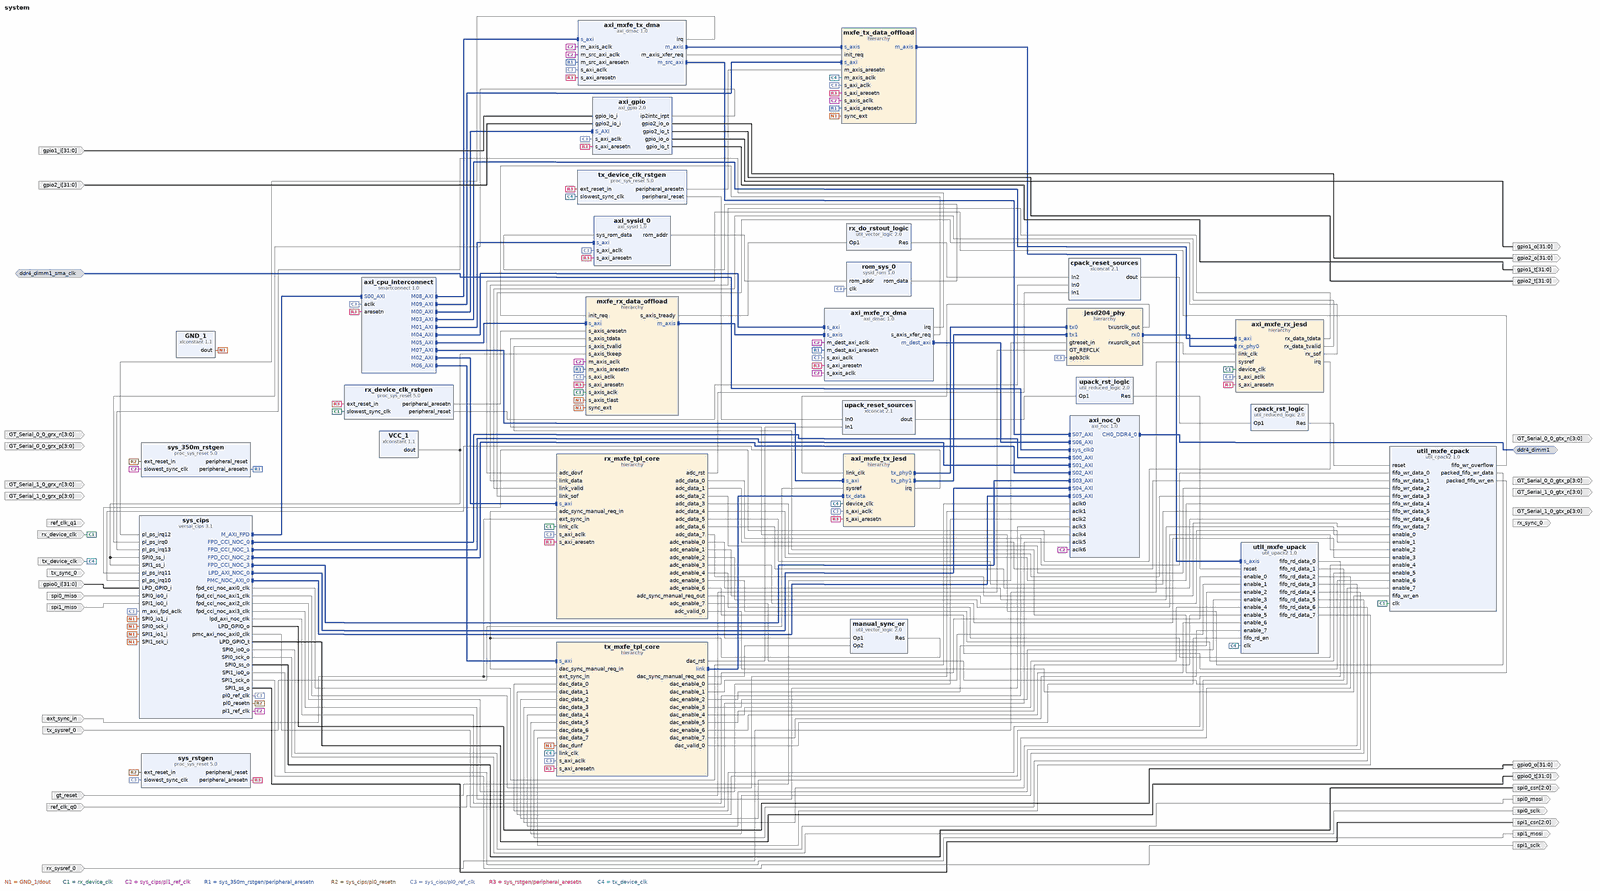
[diagram p0: block diagram of the top level, whole]
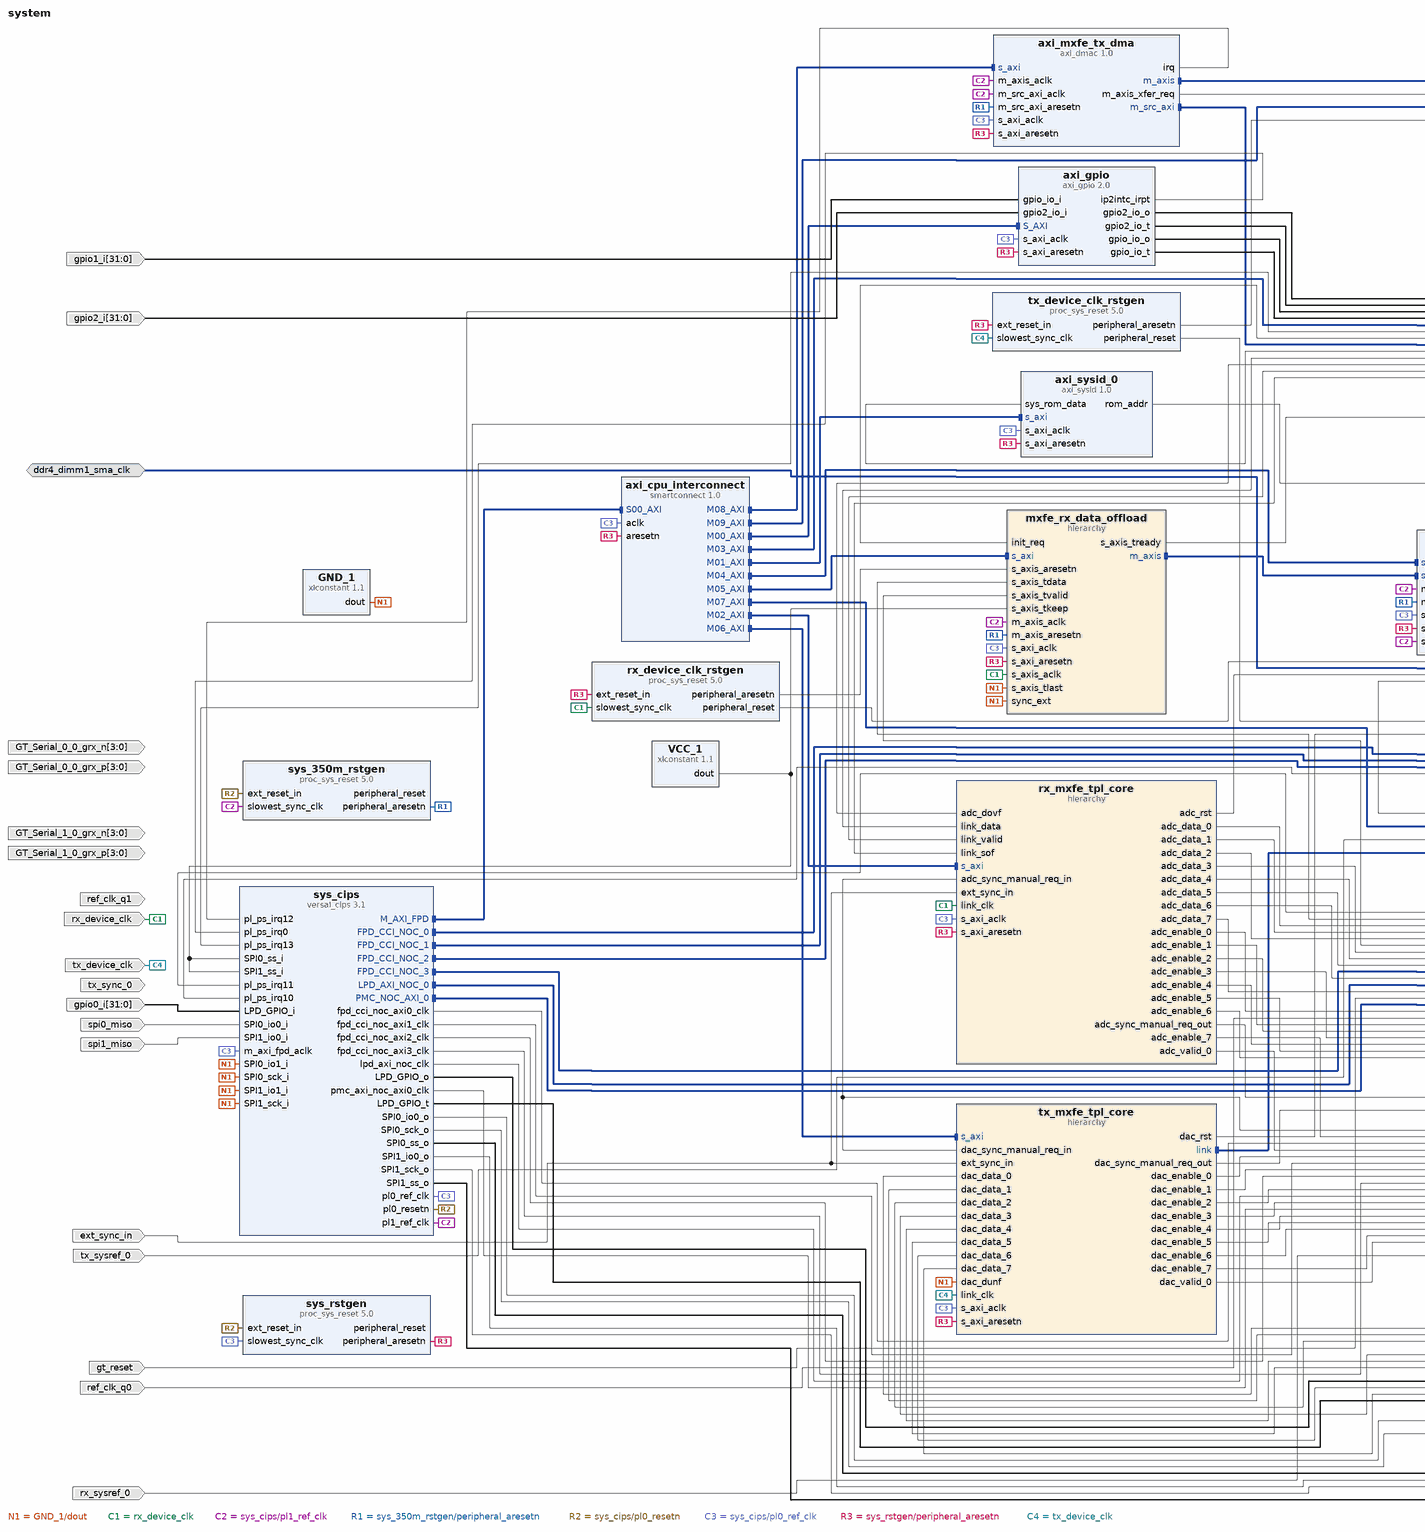
[diagram p1: block diagram of the top level, left part]
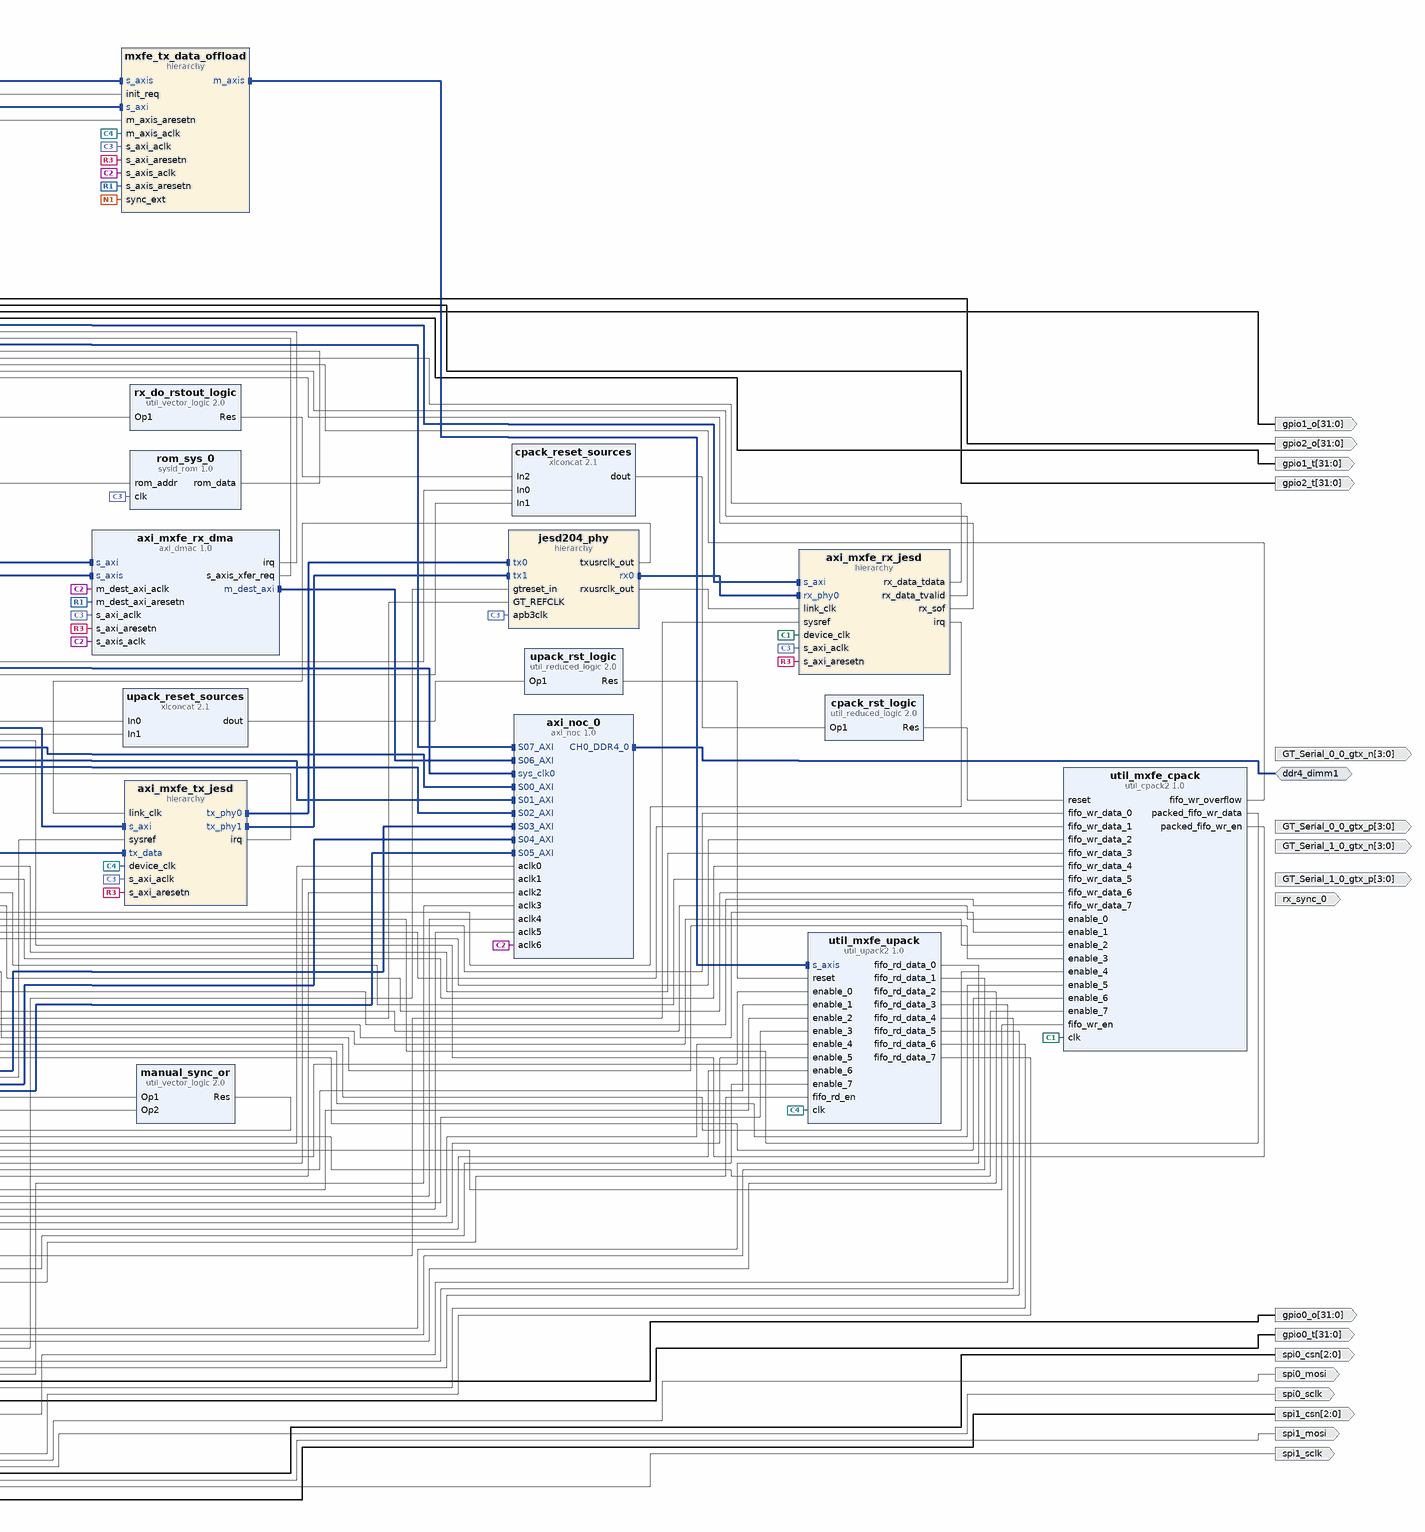
[diagram p2: block diagram of the top level, right part]
# Vivado block design system, xcvc1902-vsva2197-2MP-e-S, Vivado 2021.2
create_bd_design system

create_bd_intf_port -mode Master -vlnv xilinx.com:interface:ddr4_rtl:1.0 ddr4_dimm1
create_bd_intf_port -mode Slave -vlnv xilinx.com:interface:diff_clock_rtl:1.0 ddr4_dimm1_sma_clk
set_property -dict {CONFIG.FREQ_HZ 200000000} [get_bd_intf_ports ddr4_dimm1_sma_clk]
create_bd_port -dir O -from 2 -to 0 spi0_csn
create_bd_port -dir O spi0_sclk
create_bd_port -dir O spi0_mosi
create_bd_port -dir I spi0_miso
create_bd_port -dir O -from 2 -to 0 spi1_csn
create_bd_port -dir O spi1_sclk
create_bd_port -dir O spi1_mosi
create_bd_port -dir I spi1_miso
create_bd_port -dir I -from 31 -to 0 gpio0_i
create_bd_port -dir O -from 31 -to 0 gpio0_o
create_bd_port -dir O -from 31 -to 0 gpio0_t
create_bd_port -dir I -from 31 -to 0 gpio1_i
create_bd_port -dir O -from 31 -to 0 gpio1_o
create_bd_port -dir O -from 31 -to 0 gpio1_t
create_bd_port -dir I -from 31 -to 0 gpio2_i
create_bd_port -dir O -from 31 -to 0 gpio2_o
create_bd_port -dir O -from 31 -to 0 gpio2_t
create_bd_port -dir I gt_reset
create_bd_port -dir I rx_device_clk
create_bd_port -dir I tx_device_clk
create_bd_port -dir I ref_clk_q0
create_bd_port -dir I ref_clk_q1
create_bd_port -dir I rx_sysref_0
create_bd_port -dir O rx_sync_0
create_bd_port -dir I tx_sysref_0
create_bd_port -dir I tx_sync_0
create_bd_port -dir I -from 3 -to 0 GT_Serial_0_0_grx_p
create_bd_port -dir I -from 3 -to 0 GT_Serial_0_0_grx_n
create_bd_port -dir O -from 3 -to 0 GT_Serial_0_0_gtx_p
create_bd_port -dir O -from 3 -to 0 GT_Serial_0_0_gtx_n
create_bd_port -dir I -from 3 -to 0 GT_Serial_1_0_grx_p
create_bd_port -dir I -from 3 -to 0 GT_Serial_1_0_grx_n
create_bd_port -dir O -from 3 -to 0 GT_Serial_1_0_gtx_p
create_bd_port -dir O -from 3 -to 0 GT_Serial_1_0_gtx_n
create_bd_port -dir I ext_sync_in

create_bd_cell -type ip -vlnv xilinx.com:ip:versal_cips:3.1 sys_cips
set_property -dict [list \
  CONFIG.CLOCK_MODE Custom \
  CONFIG.DDR_MEMORY_MODE Custom \
  CONFIG.DEBUG_MODE JTAG \
  CONFIG.DESIGN_MODE 1 \
  CONFIG.IO_CONFIG_MODE Custom \
  CONFIG.PS_BOARD_INTERFACE ps_pmc_fixed_io \
  CONFIG.PS_PL_CONNECTIVITY_MODE Custom \
  CONFIG.PS_PMC_CONFIG {CLOCK_MODE Custom DDR_MEMORY_MODE {Connectivity to DDR via NOC} DEBUG_MODE JTAG DESIGN_MODE 1 IO_CONFIG_MODE Custom PCIE_APERTURES_DUAL_ENABLE 0 PCIE_APERTURES_SINGLE_ENABLE 0 PMC_CRP_PL0_REF_CTRL_FREQMHZ 100 PMC_GPIO0_MIO_PERIPHERAL {{ENABLE 1} {IO {PMC_MIO 0 .. 25}}} PMC_GPIO1_MIO_PERIPHERAL {{ENABLE 1} {IO {PMC_MIO 26 .. 51}}} PMC_MIO37 {{AUX_IO 0} {DIRECTION out} {DRIVE_STRENGTH 8mA} {OUTPUT_DATA high} {PULL pullup} {SCHMITT 0} {SLEW slow} {USAGE GPIO}} PMC_OSPI_PERIPHERAL {{ENABLE 0} {IO {PMC_MIO 0 .. 11}} {MODE Single}} PMC_QSPI_COHERENCY 0 PMC_QSPI_FBCLK {{ENABLE 1} {IO {PMC_MIO 6}}} PMC_QSPI_PERIPHERAL_DATA_MODE x4 PMC_QSPI_PERIPHERAL_ENABLE 1 PMC_QSPI_PERIPHERAL_MODE {Dual Parallel} PMC_REF_CLK_FREQMHZ 33.3333 PMC_SD1 {{CD_ENABLE 1} {CD_IO {PMC_MIO 28}} {POW_ENABLE 1} {POW_IO {PMC_MIO 51}} {RESET_ENABLE 0} {RESET_IO {PMC_MIO 12}} {WP_ENABLE 0} {WP_IO {PMC_MIO 1}}} PMC_SD1_COHERENCY 0 PMC_SD1_DATA_TRANSFER_MODE 8Bit PMC_SD1_PERIPHERAL {{ENABLE 1} {IO {PMC_MIO 26 .. 36}}} PMC_SD1_SLOT_TYPE {SD 3.0} PMC_USE_PMC_NOC_AXI0 1 PS_BOARD_INTERFACE ps_pmc_fixed_io PS_CAN1_PERIPHERAL {{ENABLE 1} {IO {PMC_MIO 40 .. 41}}} PS_ENET0_MDIO {{ENABLE 1} {IO {PS_MIO 24 .. 25}}} PS_ENET0_PERIPHERAL {{ENABLE 1} {IO {PS_MIO 0 .. 11}}} PS_ENET1_PERIPHERAL {{ENABLE 1} {IO {PS_MIO 12 .. 23}}} PS_GEN_IPI0_ENABLE 1 PS_GEN_IPI0_MASTER A72 PS_GEN_IPI1_ENABLE 1 PS_GEN_IPI2_ENABLE 1 PS_GEN_IPI3_ENABLE 1 PS_GEN_IPI4_ENABLE 1 PS_GEN_IPI5_ENABLE 1 PS_GEN_IPI6_ENABLE 1 PS_GPIO_EMIO_PERIPHERAL_ENABLE 1 PS_HSDP_EGRESS_TRAFFIC JTAG PS_HSDP_INGRESS_TRAFFIC JTAG PS_HSDP_MODE None PS_I2C0_PERIPHERAL {{ENABLE 0} {IO {PS_MIO 2 .. 3}}} PS_I2C1_PERIPHERAL {{ENABLE 1} {IO {PMC_MIO 44 .. 45}}} PS_MIO19 {{AUX_IO 0} {DIRECTION in} {DRIVE_STRENGTH 8mA} {OUTPUT_DATA default} {PULL disable} {SCHMITT 0} {SLEW slow} {USAGE Reserved}} PS_MIO21 {{AUX_IO 0} {DIRECTION in} {DRIVE_STRENGTH 8mA} {OUTPUT_DATA default} {PULL disable} {SCHMITT 0} {SLEW slow} {USAGE Reserved}} PS_MIO7 {{AUX_IO 0} {DIRECTION in} {DRIVE_STRENGTH 8mA} {OUTPUT_DATA default} {PULL disable} {SCHMITT 0} {SLEW slow} {USAGE Reserved}} PS_MIO9 {{AUX_IO 0} {DIRECTION in} {DRIVE_STRENGTH 8mA} {OUTPUT_DATA default} {PULL disable} {SCHMITT 0} {SLEW slow} {USAGE Reserved}} PS_NUM_FABRIC_RESETS 1 PS_PCIE1_PERIPHERAL_ENABLE 0 PS_PCIE2_PERIPHERAL_ENABLE 0 PS_PCIE_RESET {{ENABLE 1}} PS_PL_CONNECTIVITY_MODE Custom PS_SPI0 {{GRP_SS0_ENABLE 1} {GRP_SS0_IO EMIO} {GRP_SS1_ENABLE 1} {GRP_SS1_IO EMIO} {GRP_SS2_ENABLE 1} {GRP_SS2_IO EMIO} {PERIPHERAL_ENABLE 1} {PERIPHERAL_IO EMIO}} PS_SPI1 {{GRP_SS0_ENABLE 1} {GRP_SS0_IO EMIO} {GRP_SS1_ENABLE 1} {GRP_SS1_IO EMIO} {GRP_SS2_ENABLE 1} {GRP_SS2_IO EMIO} {PERIPHERAL_ENABLE 1} {PERIPHERAL_IO EMIO}} PS_UART0_PERIPHERAL {{ENABLE 1} {IO {PMC_MIO 42 .. 43}}} PS_USB3_PERIPHERAL {{ENABLE 1} {IO {PMC_MIO 13 .. 25}}} PS_USE_FPD_CCI_NOC 1 PS_USE_FPD_CCI_NOC0 1 PS_USE_M_AXI_FPD 1 PS_USE_NOC_LPD_AXI0 1 PS_USE_PMCPL_CLK0 1 PS_USE_PMCPL_CLK1 1 SMON_ALARMS Set_Alarms_On SMON_ENABLE_TEMP_AVERAGING 0 SMON_TEMP_AVERAGING_SAMPLES 0 PS_IRQ_USAGE {{CH0 1} {CH1 1} {CH10 1} {CH11 1} {CH12 1} {CH13 1} {CH14 1} {CH15 1} {CH2 1} {CH3 1} {CH4 1} {CH5 1} {CH6 1} {CH7 1} {CH8 1} {CH9 1}} PMC_I2CPMC_PERIPHERAL {{ENABLE 1} {IO {PMC_MIO 46 .. 47}}} } \
  CONFIG.PS_PMC_CONFIG_APPLIED 1 \
] [get_bd_cells sys_cips]
create_bd_cell -type ip -vlnv xilinx.com:ip:axi_noc:1.0 axi_noc_0
set_property -dict [list \
  CONFIG.CH0_DDR4_0_BOARD_INTERFACE ddr4_dimm1 \
  CONFIG.MC_CHAN_REGION1 DDR_LOW1 \
  CONFIG.MC_SYSTEM_CLOCK Differential \
  CONFIG.NUM_CLKS 7 \
  CONFIG.NUM_MC 1 \
  CONFIG.NUM_MCP 4 \
  CONFIG.NUM_MI 0 \
  CONFIG.NUM_SI 8 \
  CONFIG.sys_clk0_BOARD_INTERFACE ddr4_dimm1_sma_clk \
] [get_bd_cells axi_noc_0]
create_bd_cell -type ip -vlnv xilinx.com:ip:proc_sys_reset:5.0 sys_rstgen
set_property -dict {CONFIG.C_EXT_RST_WIDTH 1} [get_bd_cells sys_rstgen]
create_bd_cell -type ip -vlnv xilinx.com:ip:proc_sys_reset:5.0 sys_350m_rstgen
set_property -dict {CONFIG.C_EXT_RST_WIDTH 1} [get_bd_cells sys_350m_rstgen]
create_bd_cell -type ip -vlnv xilinx.com:ip:axi_gpio:2.0 axi_gpio
set_property -dict [list \
  CONFIG.C_GPIO2_WIDTH 32 \
  CONFIG.C_GPIO_WIDTH 32 \
  CONFIG.C_INTERRUPT_PRESENT 1 \
  CONFIG.C_IS_DUAL 1 \
] [get_bd_cells axi_gpio]
create_bd_cell -type ip -vlnv xilinx.com:ip:smartconnect:1.0 axi_cpu_interconnect
set_property -dict {CONFIG.NUM_MI 10 CONFIG.NUM_SI 1} [get_bd_cells axi_cpu_interconnect]
create_bd_cell -type ip -vlnv xilinx.com:ip:xlconstant:1.1 GND_1
set_property -dict {CONFIG.CONST_VAL 0 CONFIG.CONST_WIDTH 1} [get_bd_cells GND_1]
create_bd_cell -type ip -vlnv xilinx.com:ip:xlconstant:1.1 VCC_1
set_property -dict {CONFIG.CONST_VAL 1 CONFIG.CONST_WIDTH 1} [get_bd_cells VCC_1]
create_bd_cell -type ip -vlnv analog.com:user:axi_sysid:1.0 axi_sysid_0
set_property -dict {CONFIG.ROM_ADDR_BITS 9} [get_bd_cells axi_sysid_0]
create_bd_cell -type ip -vlnv analog.com:user:sysid_rom:1.0 rom_sys_0
set_property -dict [list \
  CONFIG.PATH_TO_FILE /home/epics/adi_2022_R2_master/hdl-master/projects/ad9081_fmca_ebz/vck190/mem_init_sys.txt \
  CONFIG.ROM_ADDR_BITS 9 \
] [get_bd_cells rom_sys_0]
create_bd_cell -type hier jesd204_phy
create_bd_cell -type ip -vlnv xilinx.com:ip:proc_sys_reset:5.0 rx_device_clk_rstgen
create_bd_cell -type hier axi_mxfe_rx_jesd
create_bd_cell -type hier rx_mxfe_tpl_core
create_bd_cell -type ip -vlnv analog.com:user:util_cpack2:1.0 util_mxfe_cpack
set_property -dict [list \
  CONFIG.NUM_OF_CHANNELS 8 \
  CONFIG.SAMPLES_PER_CHANNEL 1 \
  CONFIG.SAMPLE_DATA_WIDTH 16 \
] [get_bd_cells util_mxfe_cpack]
create_bd_cell -type hier mxfe_rx_data_offload
create_bd_cell -type ip -vlnv analog.com:user:axi_dmac:1.0 axi_mxfe_rx_dma
set_property -dict [list \
  CONFIG.AXI_SLICE_DEST true \
  CONFIG.AXI_SLICE_SRC true \
  CONFIG.CYCLIC false \
  CONFIG.DMA_2D_TRANSFER false \
  CONFIG.DMA_DATA_WIDTH_DEST 128 \
  CONFIG.DMA_DATA_WIDTH_SRC 128 \
  CONFIG.DMA_LENGTH_WIDTH 24 \
  CONFIG.DMA_TYPE_DEST 0 \
  CONFIG.DMA_TYPE_SRC 1 \
  CONFIG.ID 0 \
  CONFIG.MAX_BYTES_PER_BURST 4096 \
  CONFIG.SYNC_TRANSFER_START false \
] [get_bd_cells axi_mxfe_rx_dma]
create_bd_cell -type ip -vlnv xilinx.com:ip:proc_sys_reset:5.0 tx_device_clk_rstgen
create_bd_cell -type hier axi_mxfe_tx_jesd
create_bd_cell -type hier tx_mxfe_tpl_core
create_bd_cell -type ip -vlnv analog.com:user:util_upack2:1.0 util_mxfe_upack
set_property -dict [list \
  CONFIG.NUM_OF_CHANNELS 8 \
  CONFIG.SAMPLES_PER_CHANNEL 1 \
  CONFIG.SAMPLE_DATA_WIDTH 16 \
] [get_bd_cells util_mxfe_upack]
create_bd_cell -type hier mxfe_tx_data_offload
create_bd_cell -type ip -vlnv analog.com:user:axi_dmac:1.0 axi_mxfe_tx_dma
set_property -dict [list \
  CONFIG.AXI_SLICE_DEST true \
  CONFIG.AXI_SLICE_SRC true \
  CONFIG.CYCLIC true \
  CONFIG.DMA_2D_TRANSFER false \
  CONFIG.DMA_DATA_WIDTH_DEST 128 \
  CONFIG.DMA_DATA_WIDTH_SRC 128 \
  CONFIG.DMA_LENGTH_WIDTH 24 \
  CONFIG.DMA_TYPE_DEST 1 \
  CONFIG.DMA_TYPE_SRC 0 \
  CONFIG.ID 0 \
  CONFIG.MAX_BYTES_PER_BURST 4096 \
] [get_bd_cells axi_mxfe_tx_dma]
create_bd_cell -type ip -vlnv xilinx.com:ip:util_vector_logic:2.0 manual_sync_or
set_property -dict {CONFIG.C_OPERATION or CONFIG.C_SIZE 1} [get_bd_cells manual_sync_or]
create_bd_cell -type ip -vlnv xilinx.com:ip:util_reduced_logic:2.0 cpack_rst_logic
set_property -dict {CONFIG.C_OPERATION or CONFIG.C_SIZE 3} [get_bd_cells cpack_rst_logic]
create_bd_cell -type ip -vlnv xilinx.com:ip:util_vector_logic:2.0 rx_do_rstout_logic
set_property -dict {CONFIG.C_OPERATION not CONFIG.C_SIZE 1} [get_bd_cells rx_do_rstout_logic]
create_bd_cell -type ip -vlnv xilinx.com:ip:xlconcat:2.1 cpack_reset_sources
set_property -dict {CONFIG.NUM_PORTS 3} [get_bd_cells cpack_reset_sources]
create_bd_cell -type ip -vlnv xilinx.com:ip:util_reduced_logic:2.0 upack_rst_logic
set_property -dict {CONFIG.C_OPERATION or CONFIG.C_SIZE 2} [get_bd_cells upack_rst_logic]
create_bd_cell -type ip -vlnv xilinx.com:ip:xlconcat:2.1 upack_reset_sources
set_property -dict {CONFIG.NUM_PORTS 2} [get_bd_cells upack_reset_sources]

# ---- hierarchy /jesd204_phy ----
current_bd_instance /jesd204_phy
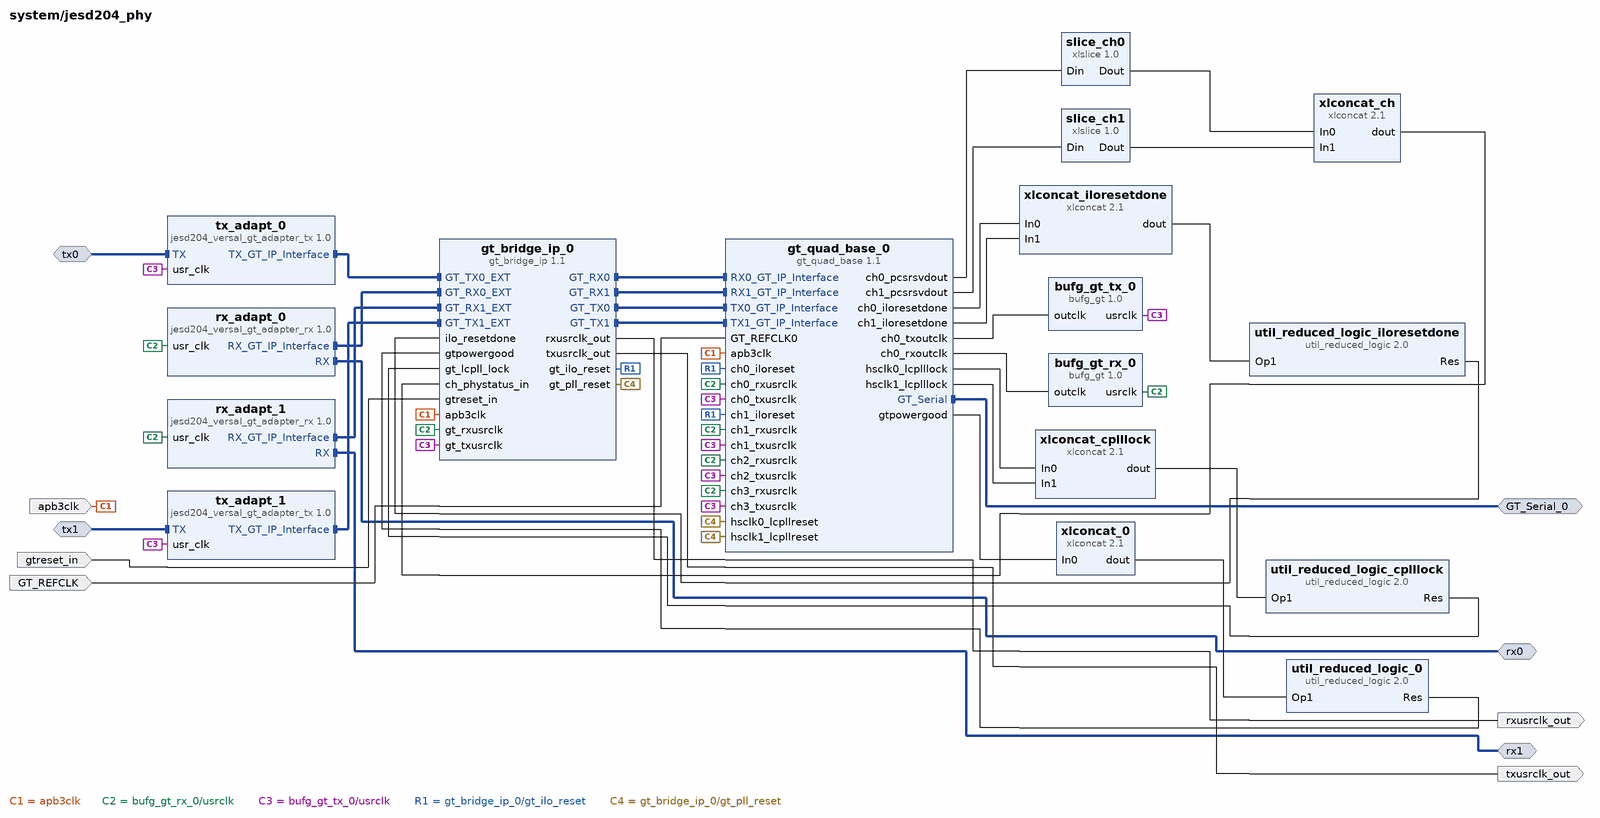
[diagram p3: block diagram inside /jesd204_phy]
create_bd_intf_pin -mode Master -vlnv xilinx.com:interface:gt_rtl:1.0 GT_Serial_0
create_bd_intf_pin -mode Master -vlnv xilinx.com:display_jesd204:jesd204_rx_bus_rtl:1.0 rx0
create_bd_intf_pin -mode Master -vlnv xilinx.com:display_jesd204:jesd204_rx_bus_rtl:1.0 rx1
create_bd_intf_pin -mode Slave -vlnv xilinx.com:display_jesd204:jesd204_tx_bus_rtl:1.0 tx0
create_bd_intf_pin -mode Slave -vlnv xilinx.com:display_jesd204:jesd204_tx_bus_rtl:1.0 tx1
create_bd_pin -dir O -type clk rxusrclk_out
create_bd_pin -dir O -type clk txusrclk_out
create_bd_pin -dir I -type clk GT_REFCLK
create_bd_pin -dir I -type clk apb3clk
create_bd_pin -dir I gtreset_in

create_bd_cell -type ip -vlnv xilinx.com:ip:gt_bridge_ip:1.1 gt_bridge_ip_0
set_property -dict [list \
  CONFIG.BYPASS_MODE true \
  CONFIG.IP_GT_DIRECTION DUPLEX \
  CONFIG.IP_LR0_SETTINGS {PRESET GTY-JESD204_64B66B INTERNAL_PRESET JESD204_64B66B GT_TYPE GTY GT_DIRECTION DUPLEX TX_LINE_RATE 6.7584 TX_PLL_TYPE LCPLL TX_REFCLK_FREQUENCY 102.4 TX_ACTUAL_REFCLK_FREQUENCY 102.4 TX_FRACN_ENABLED true TX_FRACN_NUMERATOR 0 TX_REFCLK_SOURCE R0 TX_DATA_ENCODING 64B66B_ASYNC TX_USER_DATA_WIDTH 64 TX_INT_DATA_WIDTH 64 TX_BUFFER_MODE 1 TX_BUFFER_BYPASS_MODE Fast_Sync TX_PIPM_ENABLE false TX_OUTCLK_SOURCE TXPROGDIVCLK TXPROGDIV_FREQ_ENABLE true TXPROGDIV_FREQ_SOURCE LCPLL TXPROGDIV_FREQ_VAL 102.400 TX_DIFF_SWING_EMPH_MODE CUSTOM TX_64B66B_SCRAMBLER false TX_64B66B_ENCODER false TX_64B66B_CRC false TX_RATE_GROUP A RX_LINE_RATE 6.7584 RX_PLL_TYPE LCPLL RX_REFCLK_FREQUENCY 102.4 RX_ACTUAL_REFCLK_FREQUENCY 102.4 RX_FRACN_ENABLED true RX_FRACN_NUMERATOR 0 RX_REFCLK_SOURCE R0 RX_DATA_DECODING 64B66B_ASYNC RX_USER_DATA_WIDTH 64 RX_INT_DATA_WIDTH 64 RX_BUFFER_MODE 1 RX_OUTCLK_SOURCE RXPROGDIVCLK RXPROGDIV_FREQ_ENABLE true RXPROGDIV_FREQ_SOURCE LCPLL RXPROGDIV_FREQ_VAL 102.400 INS_LOSS_NYQ 12 RX_EQ_MODE LPM RX_COUPLING AC RX_TERMINATION PROGRAMMABLE RX_RATE_GROUP A RX_TERMINATION_PROG_VALUE 800 RX_PPM_OFFSET 0 RX_64B66B_DESCRAMBLER false RX_64B66B_DECODER false RX_64B66B_CRC false OOB_ENABLE false RX_COMMA_ALIGN_WORD 1 RX_COMMA_SHOW_REALIGN_ENABLE true PCIE_ENABLE false RX_COMMA_P_ENABLE false RX_COMMA_M_ENABLE false RX_COMMA_DOUBLE_ENABLE false RX_COMMA_P_VAL 0101111100 RX_COMMA_M_VAL 1010000011 RX_COMMA_MASK 0000000000 RX_SLIDE_MODE OFF RX_SSC_PPM 0 RX_CB_NUM_SEQ 0 RX_CB_LEN_SEQ 1 RX_CB_MAX_SKEW 1 RX_CB_MAX_LEVEL 1 RX_CB_MASK_0_0 false RX_CB_VAL_0_0 00000000 RX_CB_K_0_0 false RX_CB_DISP_0_0 false RX_CB_MASK_0_1 false RX_CB_VAL_0_1 00000000 RX_CB_K_0_1 false RX_CB_DISP_0_1 false RX_CB_MASK_0_2 false RX_CB_VAL_0_2 00000000 RX_CB_K_0_2 false RX_CB_DISP_0_2 false RX_CB_MASK_0_3 false RX_CB_VAL_0_3 00000000 RX_CB_K_0_3 false RX_CB_DISP_0_3 false RX_CB_MASK_1_0 false RX_CB_VAL_1_0 00000000 RX_CB_K_1_0 false RX_CB_DISP_1_0 false RX_CB_MASK_1_1 false RX_CB_VAL_1_1 00000000 RX_CB_K_1_1 false RX_CB_DISP_1_1 false RX_CB_MASK_1_2 false RX_CB_VAL_1_2 00000000 RX_CB_K_1_2 false RX_CB_DISP_1_2 false RX_CB_MASK_1_3 false RX_CB_VAL_1_3 00000000 RX_CB_K_1_3 false RX_CB_DISP_1_3 false RX_CC_NUM_SEQ 0 RX_CC_LEN_SEQ 1 RX_CC_PERIODICITY 5000 RX_CC_KEEP_IDLE DISABLE RX_CC_PRECEDENCE ENABLE RX_CC_REPEAT_WAIT 0 RX_CC_VAL 00000000000000000000000000000000000000000000000000000000000000000000000000000000 RX_CC_MASK_0_0 false RX_CC_VAL_0_0 00000000 RX_CC_K_0_0 false RX_CC_DISP_0_0 false RX_CC_MASK_0_1 false RX_CC_VAL_0_1 00000000 RX_CC_K_0_1 false RX_CC_DISP_0_1 false RX_CC_MASK_0_2 false RX_CC_VAL_0_2 00000000 RX_CC_K_0_2 false RX_CC_DISP_0_2 false RX_CC_MASK_0_3 false RX_CC_VAL_0_3 00000000 RX_CC_K_0_3 false RX_CC_DISP_0_3 false RX_CC_MASK_1_0 false RX_CC_VAL_1_0 00000000 RX_CC_K_1_0 false RX_CC_DISP_1_0 false RX_CC_MASK_1_1 false RX_CC_VAL_1_1 00000000 RX_CC_K_1_1 false RX_CC_DISP_1_1 false RX_CC_MASK_1_2 false RX_CC_VAL_1_2 00000000 RX_CC_K_1_2 false RX_CC_DISP_1_2 false RX_CC_MASK_1_3 false RX_CC_VAL_1_3 00000000 RX_CC_K_1_3 false RX_CC_DISP_1_3 false PCIE_USERCLK2_FREQ 250 PCIE_USERCLK_FREQ 250 RX_JTOL_FC 10 RX_JTOL_LF_SLOPE -20 RX_BUFFER_BYPASS_MODE Fast_Sync RX_BUFFER_BYPASS_MODE_LANE MULTI RX_BUFFER_RESET_ON_CB_CHANGE ENABLE RX_BUFFER_RESET_ON_COMMAALIGN DISABLE RX_BUFFER_RESET_ON_RATE_CHANGE ENABLE TX_BUFFER_RESET_ON_RATE_CHANGE ENABLE RESET_SEQUENCE_INTERVAL 0 RX_COMMA_PRESET NONE RX_COMMA_VALID_ONLY 0} \
  CONFIG.IP_NO_OF_LANES 2 \
  CONFIG.IP_PRESET GTY-JESD204_64B66B \
] [get_bd_cells gt_bridge_ip_0]
create_bd_cell -type ip -vlnv xilinx.com:ip:gt_quad_base:1.1 gt_quad_base_0
set_property -dict [list \
  CONFIG.PORTS_INFO_DICT {LANE_SEL_DICT {PROT0 {RX0 RX1 TX0 TX1} unconnected {RX2 RX3 TX2 TX3}} GT_TYPE GTY REG_CONF_INTF APB3_INTF BOARD_PARAMETER { }} \
  CONFIG.PROT0_GT_DIRECTION DUPLEX \
  CONFIG.REFCLK_STRING {HSCLK0_LCPLLGTREFCLK0 refclk_PROT0_R0_102.400000046239_MHz_unique1} \
] [get_bd_cells gt_quad_base_0]
create_bd_cell -type ip -vlnv xilinx.com:ip:bufg_gt:1.0 bufg_gt_rx_0
create_bd_cell -type ip -vlnv xilinx.com:ip:bufg_gt:1.0 bufg_gt_tx_0
create_bd_cell -type ip -vlnv analog.com:user:jesd204_versal_gt_adapter_rx:1.0 rx_adapt_0
create_bd_cell -type ip -vlnv analog.com:user:jesd204_versal_gt_adapter_rx:1.0 rx_adapt_1
create_bd_cell -type ip -vlnv analog.com:user:jesd204_versal_gt_adapter_tx:1.0 tx_adapt_0
create_bd_cell -type ip -vlnv analog.com:user:jesd204_versal_gt_adapter_tx:1.0 tx_adapt_1
create_bd_cell -type ip -vlnv xilinx.com:ip:xlconcat:2.1 xlconcat_0
set_property -dict {CONFIG.NUM_PORTS 1} [get_bd_cells xlconcat_0]
create_bd_cell -type ip -vlnv xilinx.com:ip:util_reduced_logic:2.0 util_reduced_logic_0
set_property -dict {CONFIG.C_SIZE 1} [get_bd_cells util_reduced_logic_0]
create_bd_cell -type ip -vlnv xilinx.com:ip:xlconcat:2.1 xlconcat_iloresetdone
set_property -dict {CONFIG.NUM_PORTS 2} [get_bd_cells xlconcat_iloresetdone]
create_bd_cell -type ip -vlnv xilinx.com:ip:util_reduced_logic:2.0 util_reduced_logic_iloresetdone
set_property -dict {CONFIG.C_SIZE 2} [get_bd_cells util_reduced_logic_iloresetdone]
create_bd_cell -type ip -vlnv xilinx.com:ip:xlconcat:2.1 xlconcat_cplllock
set_property -dict {CONFIG.NUM_PORTS 2} [get_bd_cells xlconcat_cplllock]
create_bd_cell -type ip -vlnv xilinx.com:ip:util_reduced_logic:2.0 util_reduced_logic_cplllock
set_property -dict {CONFIG.C_SIZE 2} [get_bd_cells util_reduced_logic_cplllock]
create_bd_cell -type ip -vlnv xilinx.com:ip:xlconcat:2.1 xlconcat_ch
set_property -dict {CONFIG.NUM_PORTS 2} [get_bd_cells xlconcat_ch]
create_bd_cell -type ip -vlnv xilinx.com:ip:xlslice:1.0 slice_ch0
set_property -dict {CONFIG.DIN_WIDTH 16} [get_bd_cells slice_ch0]
create_bd_cell -type ip -vlnv xilinx.com:ip:xlslice:1.0 slice_ch1
set_property -dict {CONFIG.DIN_WIDTH 16} [get_bd_cells slice_ch1]

# ---- hierarchy /axi_mxfe_rx_jesd ----
current_bd_instance /axi_mxfe_rx_jesd
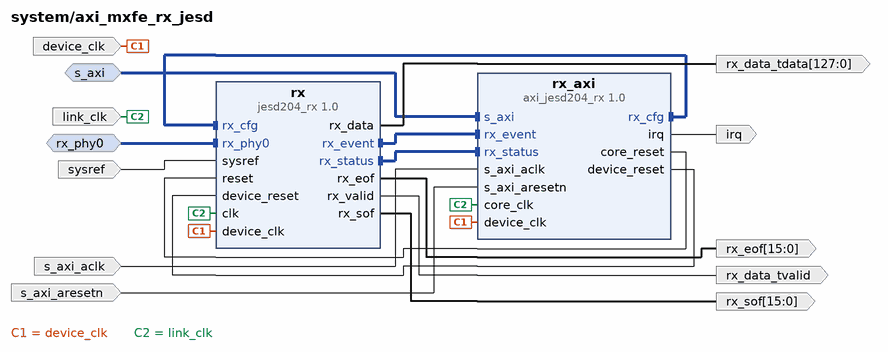
[diagram p4: block diagram inside /axi_mxfe_rx_jesd]
create_bd_intf_pin -mode Slave -vlnv xilinx.com:interface:aximm_rtl:1.0 s_axi
create_bd_intf_pin -mode Slave -vlnv xilinx.com:display_jesd204:jesd204_rx_bus_rtl:1.0 rx_phy0
create_bd_pin -dir I -type clk s_axi_aclk
create_bd_pin -dir I -type rst s_axi_aresetn
create_bd_pin -dir O -type intr irq
create_bd_pin -dir I -type clk link_clk
create_bd_pin -dir I -type clk device_clk
create_bd_pin -dir I sysref
create_bd_pin -dir O -from 15 -to 0 rx_eof
create_bd_pin -dir O -from 15 -to 0 rx_sof
create_bd_pin -dir O rx_data_tvalid
create_bd_pin -dir O -from 127 -to 0 rx_data_tdata

create_bd_cell -type ip -vlnv analog.com:user:axi_jesd204_rx:1.0 rx_axi
set_property -dict {CONFIG.LINK_MODE 2 CONFIG.NUM_LANES 1 CONFIG.NUM_LINKS 1} [get_bd_cells rx_axi]
create_bd_cell -type ip -vlnv analog.com:user:jesd204_rx:1.0 rx
set_property -dict [list \
  CONFIG.LINK_MODE 2 \
  CONFIG.NUM_INPUT_PIPELINE 1 \
  CONFIG.NUM_LANES 1 \
  CONFIG.NUM_LINKS 1 \
  CONFIG.SYSREF_IOB false \
  CONFIG.TPL_DATA_PATH_WIDTH 16 \
] [get_bd_cells rx]

# ---- hierarchy /rx_mxfe_tpl_core ----
current_bd_instance /rx_mxfe_tpl_core
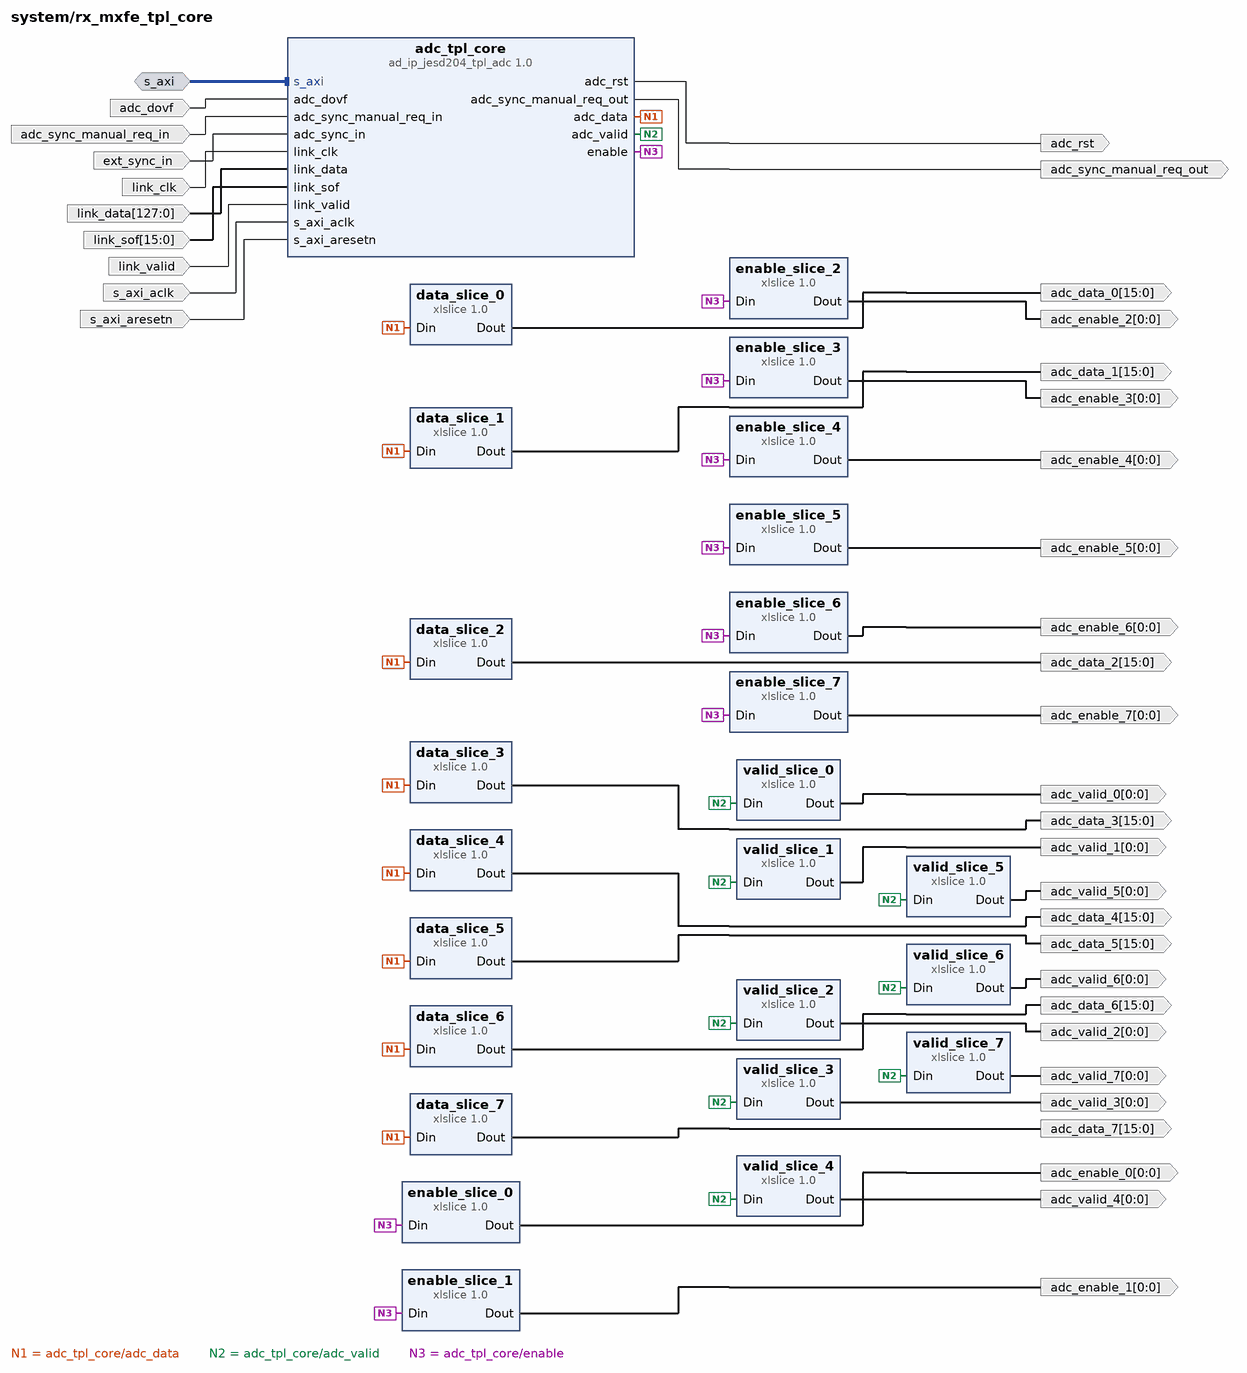
[diagram p5: block diagram inside /rx_mxfe_tpl_core]
create_bd_intf_pin -mode Slave -vlnv xilinx.com:interface:aximm_rtl:1.0 s_axi
create_bd_pin -dir I -type clk s_axi_aclk
create_bd_pin -dir I -type rst s_axi_aresetn
create_bd_pin -dir I -type clk link_clk
create_bd_pin -dir I -from 15 -to 0 link_sof
create_bd_pin -dir I link_valid
create_bd_pin -dir I -from 127 -to 0 link_data
create_bd_pin -dir I adc_dovf
create_bd_pin -dir O -from 0 -to 0 adc_enable_0
create_bd_pin -dir O -from 0 -to 0 adc_valid_0
create_bd_pin -dir O -from 15 -to 0 adc_data_0
create_bd_pin -dir O -from 0 -to 0 adc_enable_1
create_bd_pin -dir O -from 0 -to 0 adc_valid_1
create_bd_pin -dir O -from 15 -to 0 adc_data_1
create_bd_pin -dir O -from 0 -to 0 adc_enable_2
create_bd_pin -dir O -from 0 -to 0 adc_valid_2
create_bd_pin -dir O -from 15 -to 0 adc_data_2
create_bd_pin -dir O -from 0 -to 0 adc_enable_3
create_bd_pin -dir O -from 0 -to 0 adc_valid_3
create_bd_pin -dir O -from 15 -to 0 adc_data_3
create_bd_pin -dir O -from 0 -to 0 adc_enable_4
create_bd_pin -dir O -from 0 -to 0 adc_valid_4
create_bd_pin -dir O -from 15 -to 0 adc_data_4
create_bd_pin -dir O -from 0 -to 0 adc_enable_5
create_bd_pin -dir O -from 0 -to 0 adc_valid_5
create_bd_pin -dir O -from 15 -to 0 adc_data_5
create_bd_pin -dir O -from 0 -to 0 adc_enable_6
create_bd_pin -dir O -from 0 -to 0 adc_valid_6
create_bd_pin -dir O -from 15 -to 0 adc_data_6
create_bd_pin -dir O -from 0 -to 0 adc_enable_7
create_bd_pin -dir O -from 0 -to 0 adc_valid_7
create_bd_pin -dir O -from 15 -to 0 adc_data_7
create_bd_pin -dir I ext_sync_in
create_bd_pin -dir O adc_sync_manual_req_out
create_bd_pin -dir I adc_sync_manual_req_in
create_bd_pin -dir O adc_rst

create_bd_cell -type ip -vlnv analog.com:user:ad_ip_jesd204_tpl_adc:1.0 adc_tpl_core
set_property -dict [list \
  CONFIG.BITS_PER_SAMPLE 16 \
  CONFIG.CONVERTER_RESOLUTION 16 \
  CONFIG.DMA_BITS_PER_SAMPLE 16 \
  CONFIG.EXT_SYNC 1 \
  CONFIG.NUM_CHANNELS 8 \
  CONFIG.NUM_LANES 1 \
  CONFIG.OCTETS_PER_BEAT 16 \
  CONFIG.SAMPLES_PER_FRAME 1 \
] [get_bd_cells adc_tpl_core]
create_bd_cell -type ip -vlnv xilinx.com:ip:xlslice:1.0 data_slice_0
set_property -dict {CONFIG.DIN_FROM 15 CONFIG.DIN_TO 0 CONFIG.DIN_WIDTH 128} [get_bd_cells data_slice_0]
create_bd_cell -type ip -vlnv xilinx.com:ip:xlslice:1.0 enable_slice_0
set_property -dict {CONFIG.DIN_FROM 0 CONFIG.DIN_TO 0 CONFIG.DIN_WIDTH 8} [get_bd_cells enable_slice_0]
create_bd_cell -type ip -vlnv xilinx.com:ip:xlslice:1.0 valid_slice_0
set_property -dict {CONFIG.DIN_FROM 0 CONFIG.DIN_TO 0 CONFIG.DIN_WIDTH 8} [get_bd_cells valid_slice_0]
create_bd_cell -type ip -vlnv xilinx.com:ip:xlslice:1.0 data_slice_1
set_property -dict {CONFIG.DIN_FROM 31 CONFIG.DIN_TO 16 CONFIG.DIN_WIDTH 128} [get_bd_cells data_slice_1]
create_bd_cell -type ip -vlnv xilinx.com:ip:xlslice:1.0 enable_slice_1
set_property -dict {CONFIG.DIN_FROM 1 CONFIG.DIN_TO 1 CONFIG.DIN_WIDTH 8} [get_bd_cells enable_slice_1]
create_bd_cell -type ip -vlnv xilinx.com:ip:xlslice:1.0 valid_slice_1
set_property -dict {CONFIG.DIN_FROM 1 CONFIG.DIN_TO 1 CONFIG.DIN_WIDTH 8} [get_bd_cells valid_slice_1]
create_bd_cell -type ip -vlnv xilinx.com:ip:xlslice:1.0 data_slice_2
set_property -dict {CONFIG.DIN_FROM 47 CONFIG.DIN_TO 32 CONFIG.DIN_WIDTH 128} [get_bd_cells data_slice_2]
create_bd_cell -type ip -vlnv xilinx.com:ip:xlslice:1.0 enable_slice_2
set_property -dict {CONFIG.DIN_FROM 2 CONFIG.DIN_TO 2 CONFIG.DIN_WIDTH 8} [get_bd_cells enable_slice_2]
create_bd_cell -type ip -vlnv xilinx.com:ip:xlslice:1.0 valid_slice_2
set_property -dict {CONFIG.DIN_FROM 2 CONFIG.DIN_TO 2 CONFIG.DIN_WIDTH 8} [get_bd_cells valid_slice_2]
create_bd_cell -type ip -vlnv xilinx.com:ip:xlslice:1.0 data_slice_3
set_property -dict {CONFIG.DIN_FROM 63 CONFIG.DIN_TO 48 CONFIG.DIN_WIDTH 128} [get_bd_cells data_slice_3]
create_bd_cell -type ip -vlnv xilinx.com:ip:xlslice:1.0 enable_slice_3
set_property -dict {CONFIG.DIN_FROM 3 CONFIG.DIN_TO 3 CONFIG.DIN_WIDTH 8} [get_bd_cells enable_slice_3]
create_bd_cell -type ip -vlnv xilinx.com:ip:xlslice:1.0 valid_slice_3
set_property -dict {CONFIG.DIN_FROM 3 CONFIG.DIN_TO 3 CONFIG.DIN_WIDTH 8} [get_bd_cells valid_slice_3]
create_bd_cell -type ip -vlnv xilinx.com:ip:xlslice:1.0 data_slice_4
set_property -dict {CONFIG.DIN_FROM 79 CONFIG.DIN_TO 64 CONFIG.DIN_WIDTH 128} [get_bd_cells data_slice_4]
create_bd_cell -type ip -vlnv xilinx.com:ip:xlslice:1.0 enable_slice_4
set_property -dict {CONFIG.DIN_FROM 4 CONFIG.DIN_TO 4 CONFIG.DIN_WIDTH 8} [get_bd_cells enable_slice_4]
create_bd_cell -type ip -vlnv xilinx.com:ip:xlslice:1.0 valid_slice_4
set_property -dict {CONFIG.DIN_FROM 4 CONFIG.DIN_TO 4 CONFIG.DIN_WIDTH 8} [get_bd_cells valid_slice_4]
create_bd_cell -type ip -vlnv xilinx.com:ip:xlslice:1.0 data_slice_5
set_property -dict {CONFIG.DIN_FROM 95 CONFIG.DIN_TO 80 CONFIG.DIN_WIDTH 128} [get_bd_cells data_slice_5]
create_bd_cell -type ip -vlnv xilinx.com:ip:xlslice:1.0 enable_slice_5
set_property -dict {CONFIG.DIN_FROM 5 CONFIG.DIN_TO 5 CONFIG.DIN_WIDTH 8} [get_bd_cells enable_slice_5]
create_bd_cell -type ip -vlnv xilinx.com:ip:xlslice:1.0 valid_slice_5
set_property -dict {CONFIG.DIN_FROM 5 CONFIG.DIN_TO 5 CONFIG.DIN_WIDTH 8} [get_bd_cells valid_slice_5]
create_bd_cell -type ip -vlnv xilinx.com:ip:xlslice:1.0 data_slice_6
set_property -dict {CONFIG.DIN_FROM 111 CONFIG.DIN_TO 96 CONFIG.DIN_WIDTH 128} [get_bd_cells data_slice_6]
create_bd_cell -type ip -vlnv xilinx.com:ip:xlslice:1.0 enable_slice_6
set_property -dict {CONFIG.DIN_FROM 6 CONFIG.DIN_TO 6 CONFIG.DIN_WIDTH 8} [get_bd_cells enable_slice_6]
create_bd_cell -type ip -vlnv xilinx.com:ip:xlslice:1.0 valid_slice_6
set_property -dict {CONFIG.DIN_FROM 6 CONFIG.DIN_TO 6 CONFIG.DIN_WIDTH 8} [get_bd_cells valid_slice_6]
create_bd_cell -type ip -vlnv xilinx.com:ip:xlslice:1.0 data_slice_7
set_property -dict {CONFIG.DIN_FROM 127 CONFIG.DIN_TO 112 CONFIG.DIN_WIDTH 128} [get_bd_cells data_slice_7]
create_bd_cell -type ip -vlnv xilinx.com:ip:xlslice:1.0 enable_slice_7
set_property -dict {CONFIG.DIN_FROM 7 CONFIG.DIN_TO 7 CONFIG.DIN_WIDTH 8} [get_bd_cells enable_slice_7]
create_bd_cell -type ip -vlnv xilinx.com:ip:xlslice:1.0 valid_slice_7
set_property -dict {CONFIG.DIN_FROM 7 CONFIG.DIN_TO 7 CONFIG.DIN_WIDTH 8} [get_bd_cells valid_slice_7]

# ---- hierarchy /mxfe_rx_data_offload ----
current_bd_instance /mxfe_rx_data_offload
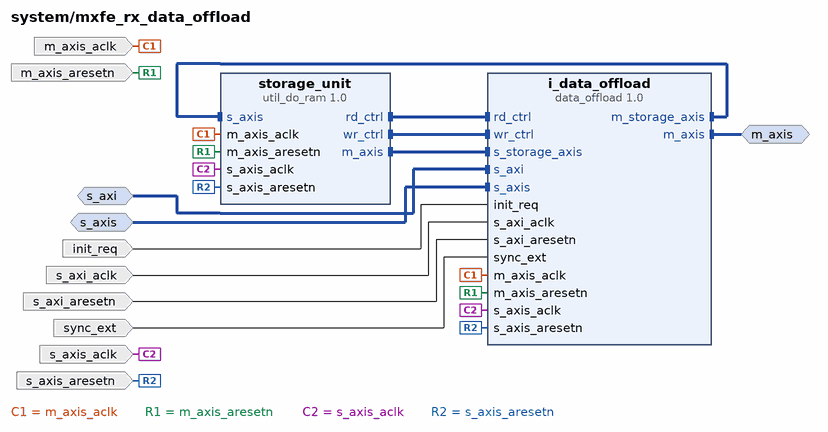
[diagram p6: block diagram inside /mxfe_rx_data_offload]
create_bd_intf_pin -mode Slave -vlnv xilinx.com:interface:aximm_rtl:1.0 s_axi
create_bd_intf_pin -mode Slave -vlnv xilinx.com:interface:axis_rtl:1.0 s_axis
create_bd_intf_pin -mode Master -vlnv xilinx.com:interface:axis_rtl:1.0 m_axis
create_bd_pin -dir I -type clk s_axi_aclk
create_bd_pin -dir I -type rst s_axi_aresetn
create_bd_pin -dir I -type clk s_axis_aclk
create_bd_pin -dir I -type rst s_axis_aresetn
create_bd_pin -dir I -type clk m_axis_aclk
create_bd_pin -dir I -type rst m_axis_aresetn
create_bd_pin -dir I init_req
create_bd_pin -dir I sync_ext

create_bd_cell -type ip -vlnv analog.com:user:data_offload:1.0 i_data_offload
set_property -dict [list \
  CONFIG.DST_DATA_WIDTH 128 \
  CONFIG.MEM_SIZE_LOG2 19 \
  CONFIG.MEM_TYPE 0 \
  CONFIG.SRC_DATA_WIDTH 128 \
  CONFIG.SYNC_EXT_ADD_INTERNAL_CDC true \
  CONFIG.TX_OR_RXN_PATH 0 \
] [get_bd_cells i_data_offload]
create_bd_cell -type ip -vlnv analog.com:user:util_do_ram:1.0 storage_unit
set_property -dict {CONFIG.DST_DATA_WIDTH 128 CONFIG.LENGTH_WIDTH 19 CONFIG.SRC_DATA_WIDTH 128} [get_bd_cells storage_unit]

# ---- hierarchy /axi_mxfe_tx_jesd ----
current_bd_instance /axi_mxfe_tx_jesd
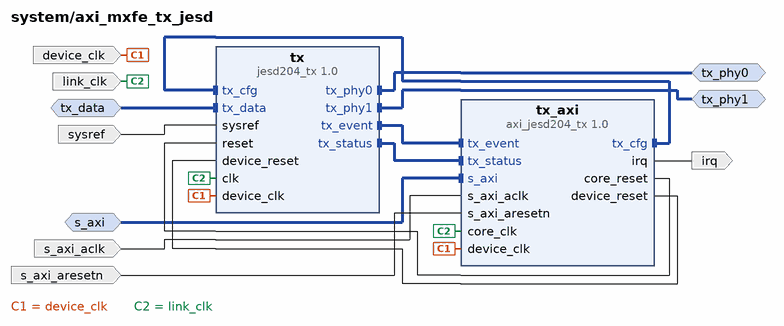
[diagram p7: block diagram inside /axi_mxfe_tx_jesd]
create_bd_intf_pin -mode Slave -vlnv xilinx.com:interface:aximm_rtl:1.0 s_axi
create_bd_intf_pin -mode Slave -vlnv xilinx.com:interface:axis_rtl:1.0 tx_data
create_bd_intf_pin -mode Master -vlnv xilinx.com:display_jesd204:jesd204_tx_bus_rtl:1.0 tx_phy0
create_bd_intf_pin -mode Master -vlnv xilinx.com:display_jesd204:jesd204_tx_bus_rtl:1.0 tx_phy1
create_bd_pin -dir I -type clk s_axi_aclk
create_bd_pin -dir I -type rst s_axi_aresetn
create_bd_pin -dir O -type intr irq
create_bd_pin -dir I -type clk link_clk
create_bd_pin -dir I -type clk device_clk
create_bd_pin -dir I sysref

create_bd_cell -type ip -vlnv analog.com:user:axi_jesd204_tx:1.0 tx_axi
set_property -dict {CONFIG.LINK_MODE 2 CONFIG.NUM_LANES 2 CONFIG.NUM_LINKS 1} [get_bd_cells tx_axi]
create_bd_cell -type ip -vlnv analog.com:user:jesd204_tx:1.0 tx
set_property -dict [list \
  CONFIG.LINK_MODE 2 \
  CONFIG.NUM_LANES 2 \
  CONFIG.NUM_LINKS 1 \
  CONFIG.SYSREF_IOB false \
  CONFIG.TPL_DATA_PATH_WIDTH 8 \
] [get_bd_cells tx]

# ---- hierarchy /tx_mxfe_tpl_core ----
current_bd_instance /tx_mxfe_tpl_core
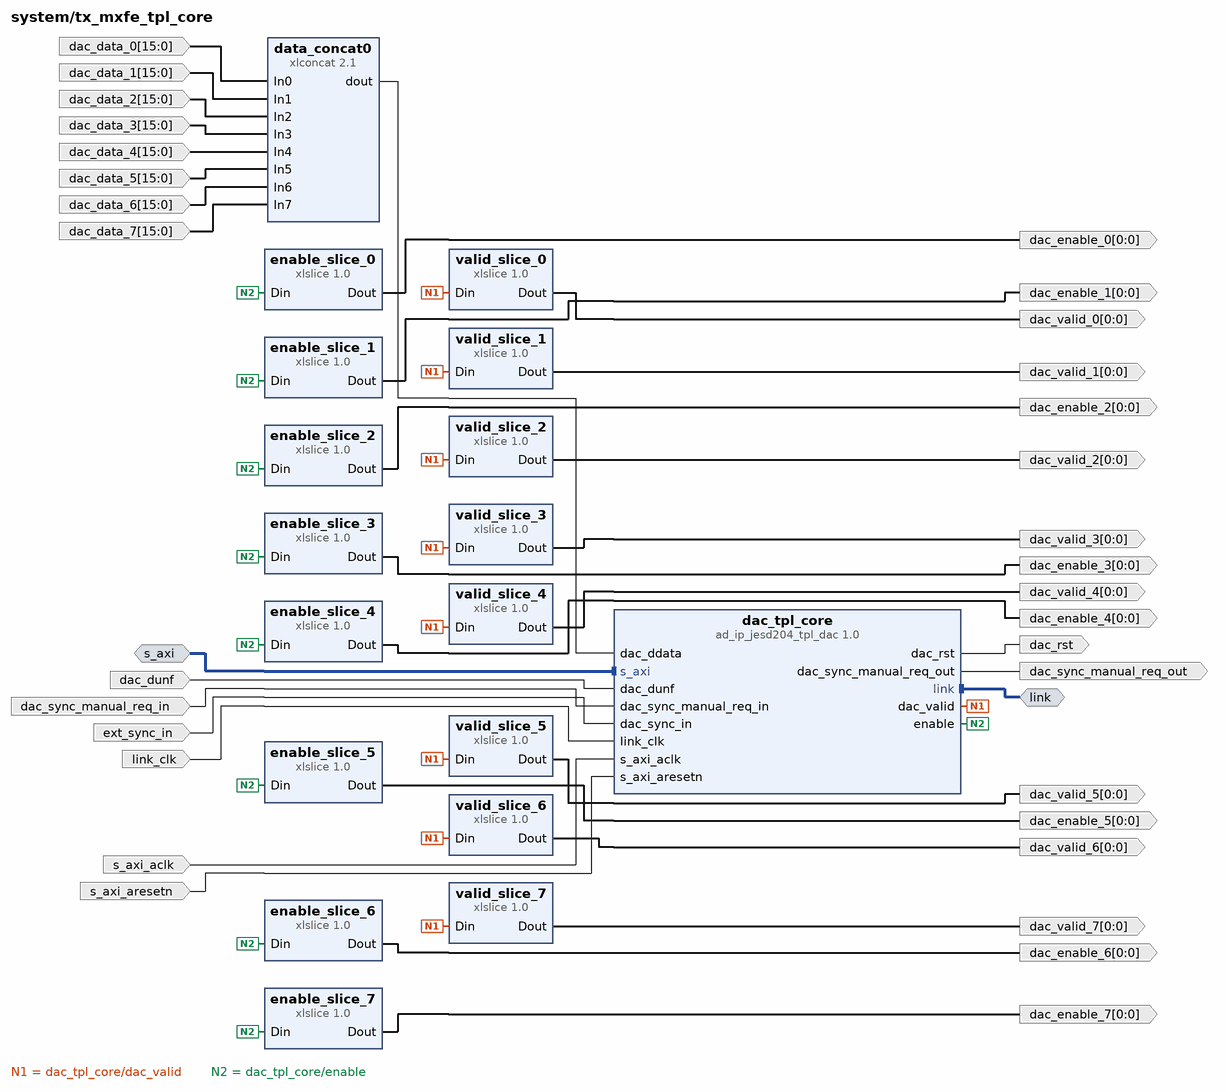
[diagram p8: block diagram inside /tx_mxfe_tpl_core]
create_bd_intf_pin -mode Slave -vlnv xilinx.com:interface:aximm_rtl:1.0 s_axi
create_bd_intf_pin -mode Master -vlnv xilinx.com:interface:axis_rtl:1.0 link
create_bd_pin -dir I -type clk s_axi_aclk
create_bd_pin -dir I -type rst s_axi_aresetn
create_bd_pin -dir I -type clk link_clk
create_bd_pin -dir I dac_dunf
create_bd_pin -dir O -from 0 -to 0 dac_enable_0
create_bd_pin -dir O -from 0 -to 0 dac_valid_0
create_bd_pin -dir I -from 15 -to 0 dac_data_0
create_bd_pin -dir O -from 0 -to 0 dac_enable_1
create_bd_pin -dir O -from 0 -to 0 dac_valid_1
create_bd_pin -dir I -from 15 -to 0 dac_data_1
create_bd_pin -dir O -from 0 -to 0 dac_enable_2
create_bd_pin -dir O -from 0 -to 0 dac_valid_2
create_bd_pin -dir I -from 15 -to 0 dac_data_2
create_bd_pin -dir O -from 0 -to 0 dac_enable_3
create_bd_pin -dir O -from 0 -to 0 dac_valid_3
create_bd_pin -dir I -from 15 -to 0 dac_data_3
create_bd_pin -dir O -from 0 -to 0 dac_enable_4
create_bd_pin -dir O -from 0 -to 0 dac_valid_4
create_bd_pin -dir I -from 15 -to 0 dac_data_4
create_bd_pin -dir O -from 0 -to 0 dac_enable_5
create_bd_pin -dir O -from 0 -to 0 dac_valid_5
create_bd_pin -dir I -from 15 -to 0 dac_data_5
create_bd_pin -dir O -from 0 -to 0 dac_enable_6
create_bd_pin -dir O -from 0 -to 0 dac_valid_6
create_bd_pin -dir I -from 15 -to 0 dac_data_6
create_bd_pin -dir O -from 0 -to 0 dac_enable_7
create_bd_pin -dir O -from 0 -to 0 dac_valid_7
create_bd_pin -dir I -from 15 -to 0 dac_data_7
create_bd_pin -dir I ext_sync_in
create_bd_pin -dir O dac_sync_manual_req_out
create_bd_pin -dir I dac_sync_manual_req_in
create_bd_pin -dir O dac_rst

create_bd_cell -type ip -vlnv analog.com:user:ad_ip_jesd204_tpl_dac:1.0 dac_tpl_core
set_property -dict [list \
  CONFIG.BITS_PER_SAMPLE 16 \
  CONFIG.CONVERTER_RESOLUTION 16 \
  CONFIG.DMA_BITS_PER_SAMPLE 16 \
  CONFIG.EXT_SYNC 1 \
  CONFIG.IQCORRECTION_DISABLE 0 \
  CONFIG.NUM_CHANNELS 8 \
  CONFIG.NUM_LANES 2 \
  CONFIG.OCTETS_PER_BEAT 8 \
  CONFIG.SAMPLES_PER_FRAME 1 \
] [get_bd_cells dac_tpl_core]
create_bd_cell -type ip -vlnv xilinx.com:ip:xlconcat:2.1 data_concat0
set_property -dict {CONFIG.NUM_PORTS 8} [get_bd_cells data_concat0]
create_bd_cell -type ip -vlnv xilinx.com:ip:xlslice:1.0 enable_slice_0
set_property -dict {CONFIG.DIN_FROM 0 CONFIG.DIN_TO 0 CONFIG.DIN_WIDTH 8} [get_bd_cells enable_slice_0]
create_bd_cell -type ip -vlnv xilinx.com:ip:xlslice:1.0 valid_slice_0
set_property -dict {CONFIG.DIN_FROM 0 CONFIG.DIN_TO 0 CONFIG.DIN_WIDTH 8} [get_bd_cells valid_slice_0]
create_bd_cell -type ip -vlnv xilinx.com:ip:xlslice:1.0 enable_slice_1
set_property -dict {CONFIG.DIN_FROM 1 CONFIG.DIN_TO 1 CONFIG.DIN_WIDTH 8} [get_bd_cells enable_slice_1]
create_bd_cell -type ip -vlnv xilinx.com:ip:xlslice:1.0 valid_slice_1
set_property -dict {CONFIG.DIN_FROM 1 CONFIG.DIN_TO 1 CONFIG.DIN_WIDTH 8} [get_bd_cells valid_slice_1]
create_bd_cell -type ip -vlnv xilinx.com:ip:xlslice:1.0 enable_slice_2
set_property -dict {CONFIG.DIN_FROM 2 CONFIG.DIN_TO 2 CONFIG.DIN_WIDTH 8} [get_bd_cells enable_slice_2]
create_bd_cell -type ip -vlnv xilinx.com:ip:xlslice:1.0 valid_slice_2
set_property -dict {CONFIG.DIN_FROM 2 CONFIG.DIN_TO 2 CONFIG.DIN_WIDTH 8} [get_bd_cells valid_slice_2]
create_bd_cell -type ip -vlnv xilinx.com:ip:xlslice:1.0 enable_slice_3
set_property -dict {CONFIG.DIN_FROM 3 CONFIG.DIN_TO 3 CONFIG.DIN_WIDTH 8} [get_bd_cells enable_slice_3]
create_bd_cell -type ip -vlnv xilinx.com:ip:xlslice:1.0 valid_slice_3
set_property -dict {CONFIG.DIN_FROM 3 CONFIG.DIN_TO 3 CONFIG.DIN_WIDTH 8} [get_bd_cells valid_slice_3]
create_bd_cell -type ip -vlnv xilinx.com:ip:xlslice:1.0 enable_slice_4
set_property -dict {CONFIG.DIN_FROM 4 CONFIG.DIN_TO 4 CONFIG.DIN_WIDTH 8} [get_bd_cells enable_slice_4]
create_bd_cell -type ip -vlnv xilinx.com:ip:xlslice:1.0 valid_slice_4
set_property -dict {CONFIG.DIN_FROM 4 CONFIG.DIN_TO 4 CONFIG.DIN_WIDTH 8} [get_bd_cells valid_slice_4]
create_bd_cell -type ip -vlnv xilinx.com:ip:xlslice:1.0 enable_slice_5
set_property -dict {CONFIG.DIN_FROM 5 CONFIG.DIN_TO 5 CONFIG.DIN_WIDTH 8} [get_bd_cells enable_slice_5]
create_bd_cell -type ip -vlnv xilinx.com:ip:xlslice:1.0 valid_slice_5
set_property -dict {CONFIG.DIN_FROM 5 CONFIG.DIN_TO 5 CONFIG.DIN_WIDTH 8} [get_bd_cells valid_slice_5]
create_bd_cell -type ip -vlnv xilinx.com:ip:xlslice:1.0 enable_slice_6
set_property -dict {CONFIG.DIN_FROM 6 CONFIG.DIN_TO 6 CONFIG.DIN_WIDTH 8} [get_bd_cells enable_slice_6]
create_bd_cell -type ip -vlnv xilinx.com:ip:xlslice:1.0 valid_slice_6
set_property -dict {CONFIG.DIN_FROM 6 CONFIG.DIN_TO 6 CONFIG.DIN_WIDTH 8} [get_bd_cells valid_slice_6]
create_bd_cell -type ip -vlnv xilinx.com:ip:xlslice:1.0 enable_slice_7
set_property -dict {CONFIG.DIN_FROM 7 CONFIG.DIN_TO 7 CONFIG.DIN_WIDTH 8} [get_bd_cells enable_slice_7]
create_bd_cell -type ip -vlnv xilinx.com:ip:xlslice:1.0 valid_slice_7
set_property -dict {CONFIG.DIN_FROM 7 CONFIG.DIN_TO 7 CONFIG.DIN_WIDTH 8} [get_bd_cells valid_slice_7]

# ---- hierarchy /mxfe_tx_data_offload ----
current_bd_instance /mxfe_tx_data_offload
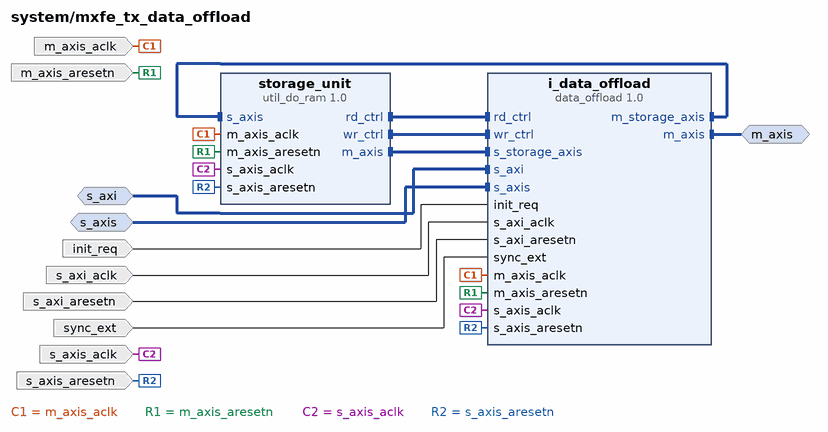
[diagram p9: block diagram inside /mxfe_tx_data_offload]
create_bd_intf_pin -mode Slave -vlnv xilinx.com:interface:aximm_rtl:1.0 s_axi
create_bd_intf_pin -mode Slave -vlnv xilinx.com:interface:axis_rtl:1.0 s_axis
create_bd_intf_pin -mode Master -vlnv xilinx.com:interface:axis_rtl:1.0 m_axis
create_bd_pin -dir I -type clk s_axi_aclk
create_bd_pin -dir I -type rst s_axi_aresetn
create_bd_pin -dir I -type clk s_axis_aclk
create_bd_pin -dir I -type rst s_axis_aresetn
create_bd_pin -dir I -type clk m_axis_aclk
create_bd_pin -dir I -type rst m_axis_aresetn
create_bd_pin -dir I init_req
create_bd_pin -dir I sync_ext

create_bd_cell -type ip -vlnv analog.com:user:data_offload:1.0 i_data_offload
set_property -dict [list \
  CONFIG.DST_CYCLIC_EN 1 \
  CONFIG.DST_DATA_WIDTH 128 \
  CONFIG.MEM_SIZE_LOG2 19 \
  CONFIG.MEM_TYPE 0 \
  CONFIG.SRC_DATA_WIDTH 128 \
  CONFIG.SYNC_EXT_ADD_INTERNAL_CDC true \
  CONFIG.TX_OR_RXN_PATH 1 \
] [get_bd_cells i_data_offload]
create_bd_cell -type ip -vlnv analog.com:user:util_do_ram:1.0 storage_unit
set_property -dict {CONFIG.DST_DATA_WIDTH 128 CONFIG.LENGTH_WIDTH 19 CONFIG.SRC_DATA_WIDTH 128} [get_bd_cells storage_unit]

# ---- connections ----

current_bd_instance /jesd204_phy
connect_bd_intf_net [get_bd_intf_pins gt_bridge_ip_0/GT_RX0] [get_bd_intf_pins gt_quad_base_0/RX0_GT_IP_Interface]
connect_bd_intf_net [get_bd_intf_pins gt_bridge_ip_0/GT_RX1] [get_bd_intf_pins gt_quad_base_0/RX1_GT_IP_Interface]
connect_bd_intf_net [get_bd_intf_pins gt_bridge_ip_0/GT_TX0] [get_bd_intf_pins gt_quad_base_0/TX0_GT_IP_Interface]
connect_bd_intf_net [get_bd_intf_pins gt_bridge_ip_0/GT_TX1] [get_bd_intf_pins gt_quad_base_0/TX1_GT_IP_Interface]
connect_bd_intf_net [get_bd_intf_pins GT_Serial_0] [get_bd_intf_pins gt_quad_base_0/GT_Serial]
connect_bd_intf_net [get_bd_intf_pins rx0] [get_bd_intf_pins rx_adapt_0/RX]
connect_bd_intf_net [get_bd_intf_pins rx_adapt_0/RX_GT_IP_Interface] [get_bd_intf_pins gt_bridge_ip_0/GT_RX0_EXT]
connect_bd_intf_net [get_bd_intf_pins rx1] [get_bd_intf_pins rx_adapt_1/RX]
connect_bd_intf_net [get_bd_intf_pins rx_adapt_1/RX_GT_IP_Interface] [get_bd_intf_pins gt_bridge_ip_0/GT_RX1_EXT]
connect_bd_intf_net [get_bd_intf_pins tx0] [get_bd_intf_pins tx_adapt_0/TX]
connect_bd_intf_net [get_bd_intf_pins tx1] [get_bd_intf_pins tx_adapt_1/TX]
connect_bd_intf_net [get_bd_intf_pins tx_adapt_0/TX_GT_IP_Interface] [get_bd_intf_pins gt_bridge_ip_0/GT_TX0_EXT]
connect_bd_intf_net [get_bd_intf_pins tx_adapt_1/TX_GT_IP_Interface] [get_bd_intf_pins gt_bridge_ip_0/GT_TX1_EXT]
connect_bd_net [get_bd_pins GT_REFCLK] [get_bd_pins gt_quad_base_0/GT_REFCLK0]
connect_bd_net [get_bd_pins apb3clk] [get_bd_pins gt_bridge_ip_0/apb3clk] [get_bd_pins gt_quad_base_0/apb3clk]
connect_bd_net [get_bd_pins bufg_gt_rx_0/usrclk] \
  [get_bd_pins gt_bridge_ip_0/gt_rxusrclk] [get_bd_pins rx_adapt_0/usr_clk] [get_bd_pins rx_adapt_1/usr_clk] \
  [get_bd_pins gt_quad_base_0/ch0_rxusrclk] [get_bd_pins gt_quad_base_0/ch1_rxusrclk] \
  [get_bd_pins gt_quad_base_0/ch2_rxusrclk] [get_bd_pins gt_quad_base_0/ch3_rxusrclk]
connect_bd_net [get_bd_pins bufg_gt_tx_0/usrclk] \
  [get_bd_pins gt_bridge_ip_0/gt_txusrclk] [get_bd_pins tx_adapt_0/usr_clk] [get_bd_pins tx_adapt_1/usr_clk] \
  [get_bd_pins gt_quad_base_0/ch0_txusrclk] [get_bd_pins gt_quad_base_0/ch1_txusrclk] \
  [get_bd_pins gt_quad_base_0/ch2_txusrclk] [get_bd_pins gt_quad_base_0/ch3_txusrclk]
connect_bd_net [get_bd_pins gt_bridge_ip_0/gt_ilo_reset] [get_bd_pins gt_quad_base_0/ch0_iloreset] [get_bd_pins gt_quad_base_0/ch1_iloreset]
connect_bd_net [get_bd_pins gt_bridge_ip_0/gt_pll_reset] [get_bd_pins gt_quad_base_0/hsclk0_lcpllreset] [get_bd_pins gt_quad_base_0/hsclk1_lcpllreset]
connect_bd_net [get_bd_pins gt_bridge_ip_0/rxusrclk_out] [get_bd_pins rxusrclk_out]
connect_bd_net [get_bd_pins gt_bridge_ip_0/txusrclk_out] [get_bd_pins txusrclk_out]
connect_bd_net [get_bd_pins gt_quad_base_0/ch0_iloresetdone] [get_bd_pins xlconcat_iloresetdone/In0]
connect_bd_net [get_bd_pins gt_quad_base_0/ch0_pcsrsvdout] [get_bd_pins slice_ch0/Din]
connect_bd_net [get_bd_pins gt_quad_base_0/ch0_rxoutclk] [get_bd_pins bufg_gt_rx_0/outclk]
connect_bd_net [get_bd_pins gt_quad_base_0/ch0_txoutclk] [get_bd_pins bufg_gt_tx_0/outclk]
connect_bd_net [get_bd_pins gt_quad_base_0/ch1_iloresetdone] [get_bd_pins xlconcat_iloresetdone/In1]
connect_bd_net [get_bd_pins gt_quad_base_0/ch1_pcsrsvdout] [get_bd_pins slice_ch1/Din]
connect_bd_net [get_bd_pins gt_quad_base_0/gtpowergood] [get_bd_pins xlconcat_0/In0]
connect_bd_net [get_bd_pins gt_quad_base_0/hsclk0_lcplllock] [get_bd_pins xlconcat_cplllock/In0]
connect_bd_net [get_bd_pins gt_quad_base_0/hsclk1_lcplllock] [get_bd_pins xlconcat_cplllock/In1]
connect_bd_net [get_bd_pins gtreset_in] [get_bd_pins gt_bridge_ip_0/gtreset_in]
connect_bd_net [get_bd_pins slice_ch0/Dout] [get_bd_pins xlconcat_ch/In0]
connect_bd_net [get_bd_pins slice_ch1/Dout] [get_bd_pins xlconcat_ch/In1]
connect_bd_net [get_bd_pins util_reduced_logic_0/Res] [get_bd_pins gt_bridge_ip_0/gtpowergood]
connect_bd_net [get_bd_pins util_reduced_logic_cplllock/Res] [get_bd_pins gt_bridge_ip_0/gt_lcpll_lock]
connect_bd_net [get_bd_pins util_reduced_logic_iloresetdone/Res] [get_bd_pins gt_bridge_ip_0/ilo_resetdone]
connect_bd_net [get_bd_pins xlconcat_0/dout] [get_bd_pins util_reduced_logic_0/Op1]
connect_bd_net [get_bd_pins xlconcat_ch/dout] [get_bd_pins gt_bridge_ip_0/ch_phystatus_in]
connect_bd_net [get_bd_pins xlconcat_cplllock/dout] [get_bd_pins util_reduced_logic_cplllock/Op1]
connect_bd_net [get_bd_pins xlconcat_iloresetdone/dout] [get_bd_pins util_reduced_logic_iloresetdone/Op1]

current_bd_instance /axi_mxfe_rx_jesd
connect_bd_intf_net [get_bd_intf_pins rx_axi/rx_cfg] [get_bd_intf_pins rx/rx_cfg]
connect_bd_intf_net [get_bd_intf_pins rx_phy0] [get_bd_intf_pins rx/rx_phy0]
connect_bd_intf_net [get_bd_intf_pins rx/rx_event] [get_bd_intf_pins rx_axi/rx_event]
connect_bd_intf_net [get_bd_intf_pins rx/rx_status] [get_bd_intf_pins rx_axi/rx_status]
connect_bd_intf_net [get_bd_intf_pins s_axi] [get_bd_intf_pins rx_axi/s_axi]
connect_bd_net [get_bd_pins device_clk] [get_bd_pins rx_axi/device_clk] [get_bd_pins rx/device_clk]
connect_bd_net [get_bd_pins link_clk] [get_bd_pins rx_axi/core_clk] [get_bd_pins rx/clk]
connect_bd_net [get_bd_pins rx_axi/core_reset] [get_bd_pins rx/reset]
connect_bd_net [get_bd_pins rx_axi/device_reset] [get_bd_pins rx/device_reset]
connect_bd_net [get_bd_pins rx_axi/irq] [get_bd_pins irq]
connect_bd_net [get_bd_pins rx/rx_data] [get_bd_pins rx_data_tdata]
connect_bd_net [get_bd_pins rx/rx_eof] [get_bd_pins rx_eof]
connect_bd_net [get_bd_pins rx/rx_sof] [get_bd_pins rx_sof]
connect_bd_net [get_bd_pins rx/rx_valid] [get_bd_pins rx_data_tvalid]
connect_bd_net [get_bd_pins s_axi_aclk] [get_bd_pins rx_axi/s_axi_aclk]
connect_bd_net [get_bd_pins s_axi_aresetn] [get_bd_pins rx_axi/s_axi_aresetn]
connect_bd_net [get_bd_pins sysref] [get_bd_pins rx/sysref]

current_bd_instance /rx_mxfe_tpl_core
connect_bd_intf_net [get_bd_intf_pins s_axi] [get_bd_intf_pins adc_tpl_core/s_axi]
connect_bd_net [get_bd_pins adc_dovf] [get_bd_pins adc_tpl_core/adc_dovf]
connect_bd_net [get_bd_pins adc_sync_manual_req_in] [get_bd_pins adc_tpl_core/adc_sync_manual_req_in]
connect_bd_net [get_bd_pins adc_tpl_core/adc_data] \
  [get_bd_pins data_slice_0/Din] [get_bd_pins data_slice_1/Din] [get_bd_pins data_slice_2/Din] [get_bd_pins data_slice_3/Din] \
  [get_bd_pins data_slice_4/Din] [get_bd_pins data_slice_5/Din] [get_bd_pins data_slice_6/Din] [get_bd_pins data_slice_7/Din]
connect_bd_net [get_bd_pins adc_tpl_core/adc_rst] [get_bd_pins adc_rst]
connect_bd_net [get_bd_pins adc_tpl_core/adc_sync_manual_req_out] [get_bd_pins adc_sync_manual_req_out]
connect_bd_net [get_bd_pins adc_tpl_core/adc_valid] \
  [get_bd_pins valid_slice_0/Din] [get_bd_pins valid_slice_1/Din] [get_bd_pins valid_slice_2/Din] \
  [get_bd_pins valid_slice_3/Din] [get_bd_pins valid_slice_4/Din] [get_bd_pins valid_slice_5/Din] \
  [get_bd_pins valid_slice_6/Din] [get_bd_pins valid_slice_7/Din]
connect_bd_net [get_bd_pins adc_tpl_core/enable] \
  [get_bd_pins enable_slice_0/Din] [get_bd_pins enable_slice_1/Din] [get_bd_pins enable_slice_2/Din] \
  [get_bd_pins enable_slice_3/Din] [get_bd_pins enable_slice_4/Din] [get_bd_pins enable_slice_5/Din] \
  [get_bd_pins enable_slice_6/Din] [get_bd_pins enable_slice_7/Din]
connect_bd_net [get_bd_pins data_slice_0/Dout] [get_bd_pins adc_data_0]
connect_bd_net [get_bd_pins data_slice_1/Dout] [get_bd_pins adc_data_1]
connect_bd_net [get_bd_pins data_slice_2/Dout] [get_bd_pins adc_data_2]
connect_bd_net [get_bd_pins data_slice_3/Dout] [get_bd_pins adc_data_3]
connect_bd_net [get_bd_pins data_slice_4/Dout] [get_bd_pins adc_data_4]
connect_bd_net [get_bd_pins data_slice_5/Dout] [get_bd_pins adc_data_5]
connect_bd_net [get_bd_pins data_slice_6/Dout] [get_bd_pins adc_data_6]
connect_bd_net [get_bd_pins data_slice_7/Dout] [get_bd_pins adc_data_7]
connect_bd_net [get_bd_pins enable_slice_0/Dout] [get_bd_pins adc_enable_0]
connect_bd_net [get_bd_pins enable_slice_1/Dout] [get_bd_pins adc_enable_1]
connect_bd_net [get_bd_pins enable_slice_2/Dout] [get_bd_pins adc_enable_2]
connect_bd_net [get_bd_pins enable_slice_3/Dout] [get_bd_pins adc_enable_3]
connect_bd_net [get_bd_pins enable_slice_4/Dout] [get_bd_pins adc_enable_4]
connect_bd_net [get_bd_pins enable_slice_5/Dout] [get_bd_pins adc_enable_5]
connect_bd_net [get_bd_pins enable_slice_6/Dout] [get_bd_pins adc_enable_6]
connect_bd_net [get_bd_pins enable_slice_7/Dout] [get_bd_pins adc_enable_7]
connect_bd_net [get_bd_pins ext_sync_in] [get_bd_pins adc_tpl_core/adc_sync_in]
connect_bd_net [get_bd_pins link_clk] [get_bd_pins adc_tpl_core/link_clk]
connect_bd_net [get_bd_pins link_data] [get_bd_pins adc_tpl_core/link_data]
connect_bd_net [get_bd_pins link_sof] [get_bd_pins adc_tpl_core/link_sof]
connect_bd_net [get_bd_pins link_valid] [get_bd_pins adc_tpl_core/link_valid]
connect_bd_net [get_bd_pins s_axi_aclk] [get_bd_pins adc_tpl_core/s_axi_aclk]
connect_bd_net [get_bd_pins s_axi_aresetn] [get_bd_pins adc_tpl_core/s_axi_aresetn]
connect_bd_net [get_bd_pins valid_slice_0/Dout] [get_bd_pins adc_valid_0]
connect_bd_net [get_bd_pins valid_slice_1/Dout] [get_bd_pins adc_valid_1]
connect_bd_net [get_bd_pins valid_slice_2/Dout] [get_bd_pins adc_valid_2]
connect_bd_net [get_bd_pins valid_slice_3/Dout] [get_bd_pins adc_valid_3]
connect_bd_net [get_bd_pins valid_slice_4/Dout] [get_bd_pins adc_valid_4]
connect_bd_net [get_bd_pins valid_slice_5/Dout] [get_bd_pins adc_valid_5]
connect_bd_net [get_bd_pins valid_slice_6/Dout] [get_bd_pins adc_valid_6]
connect_bd_net [get_bd_pins valid_slice_7/Dout] [get_bd_pins adc_valid_7]
